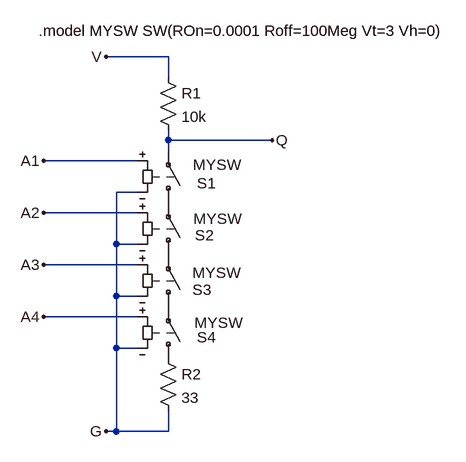
[diagram p0: schematic myNand.asc]
myNand.asc, the LTspice schematic file:
Version 4
SHEET 1 880 680
WIRE 208 -64 112 -64
WIRE 208 -32 208 -64
WIRE 208 64 208 48
WIRE 368 64 208 64
WIRE 208 80 208 64
WIRE 160 96 16 96
WIRE 160 144 128 144
WIRE 160 176 16 176
WIRE 128 224 128 144
WIRE 160 224 128 224
WIRE 160 256 16 256
WIRE 128 304 128 224
WIRE 160 304 128 304
WIRE 160 336 16 336
WIRE 128 384 128 304
WIRE 160 384 128 384
WIRE 128 512 128 384
WIRE 128 512 112 512
WIRE 208 512 208 480
WIRE 208 512 128 512
FLAG 368 64 Q
FLAG 16 96 A1
FLAG 16 176 A2
FLAG 16 256 A3
FLAG 16 336 A4
FLAG 112 -64 V
FLAG 112 512 G
SYMBOL sw 208 176 M180
WINDOW 0 44 46 Left 2
WINDOW 3 38 74 Left 2
SYMATTR InstName S1
SYMATTR Value MYSW
SYMBOL sw 208 256 M180
WINDOW 0 41 46 Left 2
WINDOW 3 39 71 Left 2
SYMATTR InstName S2
SYMATTR Value MYSW
SYMBOL res 192 -48 R0
SYMATTR InstName R1
SYMATTR Value 10k
SYMBOL sw 208 336 M180
WINDOW 0 37 42 Left 2
WINDOW 3 37 68 Left 2
SYMATTR InstName S3
SYMATTR Value MYSW
SYMBOL sw 208 416 M180
WINDOW 0 44 49 Left 2
WINDOW 3 40 71 Left 2
SYMATTR InstName S4
SYMATTR Value MYSW
SYMBOL res 192 384 R0
SYMATTR InstName R2
SYMATTR Value 33
TEXT 8 -104 Left 2 !.model MYSW SW(ROn=0.0001 Roff=100Meg Vt=3 Vh=0)

The netlist it stands for:
* myNand.asc
S1 P001 Q A1 G MYSW
S2 P002 P001 A2 G MYSW
R1 V Q 10k
S3 P003 P002 A3 G MYSW
S4 P004 P003 A4 G MYSW
R2 P004 G 33
.model MYSW SW(ROn=0.0001 Roff=100Meg Vt=3 Vh=0)
.backanno
.end